# Altium schematic sheet [04].HMS.Output.SchDoc
size A4; SheetNumber: 5; SheetTotal: 7
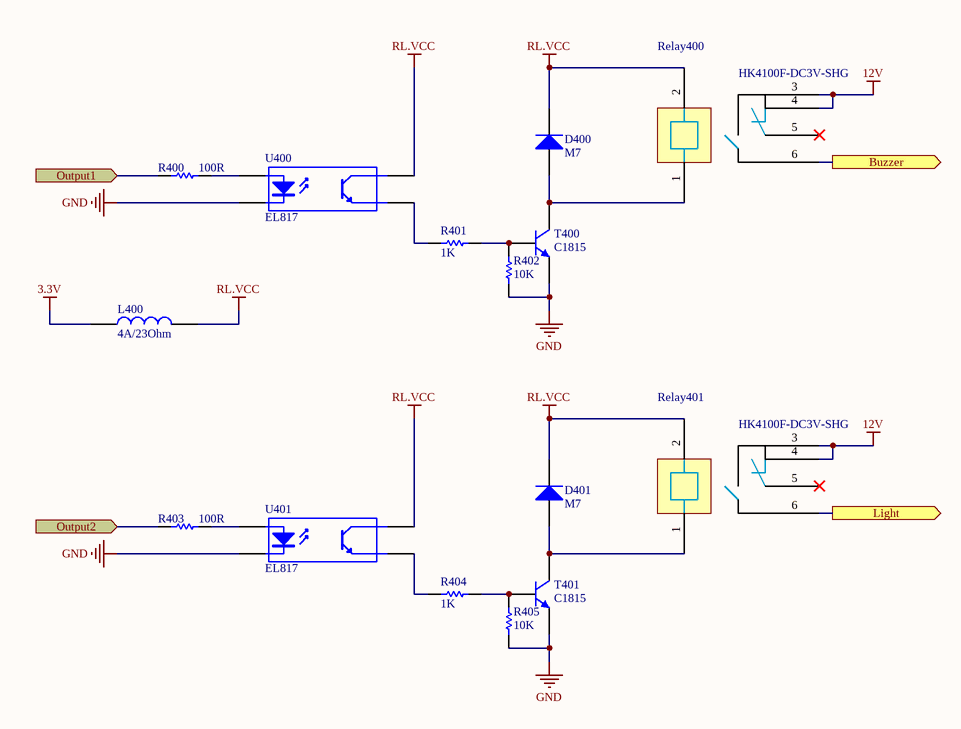
[diagram p0: [04].HMS.Output.SchDoc]

## Parts
D400  M7  [DO214AC_SMA_1808]
D401  M7  [DO214AC_SMA_1808]
L400  4A/23Ohm  [Inductor_0603]
R400  100R  [RES_0402(1005)]
R401  1K  [RES_0402(1005)]
R402  10K  [RES_0402(1005)]
R403  100R  [RES_0402(1005)]
R404  1K  [RES_0402(1005)]
R405  10K  [RES_0402(1005)]
Relay400  HK4100F-DC3V-SHG  [HK4001F]
Relay401  HK4100F-DC3V-SHG  [HK4001F]
T400  C1815  [SOT23-3]
T401  C1815  [SOT23-3]
U400  EL817  [Opto small]
U401  EL817  [Opto small]

## Ports
Buzzer (out), Light (out), Output1 (in), Output2 (in)

## Nets
3.3V: L400.1
12V: Relay400.3 Relay400.4 Relay401.3 Relay401.4
GND: R402.1 R405.1 T400.2(E) T401.2(E) U400.2 U401.2
RL.VCC: D400.2(K) D401.2(K) L400.2 Relay400.2 Relay401.2 U400.4 U401.4
Buzzer: Relay400.6 ; port Buzzer
Light: Relay401.6 ; port Light
Output1: R400.2 ; port Output1
Output2: R403.2 ; port Output2
NetD400_1: D400.1(A) Relay400.1 T400.3(C)
NetD401_1: D401.1(A) Relay401.1 T401.3(C)
NetR400_1: R400.1 U400.1
NetR401_1: R401.1 R402.2 T400.1(B)
NetR401_2: R401.2 U400.3
NetR403_1: R403.1 U401.1
NetR404_1: R404.1 R405.2 T401.1(B)
NetR404_2: R404.2 U401.3

Not connected (* = marked no-connect by the designer): Relay400 5*; Relay401 5*

## Library data of the parts
D400 D401 = Diode M7: Diode M7 - 1N4007; MPN: 1N4007 M7; Value: 1000V 1A; Published: 8-Jun-2000; LatestRevisionDate: 17-Jul-2002; LatestRevisionNote: Re-released for DXP Platform.; DatasheetDocument: 1997; PackageReference: DO-35; Publisher: Altium Limited; Code_JEDEC: DO-204-AH; ComponentLink1Description: Manufacturer Link; ComponentLink1URL: http://www.fairchildsemi.com/; ComponentLink2Description: Datasheet; ComponentLink2URL: http://www.fairchildsemi.com/ds/1N%2F1N4448.pdf; Category: Diode
L400 = FBMJ1608HM230NT: Inductor Ferrites 4A SMD 0603; MFR: Taiyo Yuden; MPN: FBMJ1608HM230NT; Category: Ferrite Beads and Chips; Value: 4A/23Ohm
R400 R403 = Res1: RES 100 OHM 1% 1/8W 0402; MPN: RC0402FR-7W100RL; MFR: YAGEO; Value: 300R; Published: 8-Jun-2000; LatestRevisionDate: 17-Jul-2002; LatestRevisionNote: Re-released for DXP Platform.; PackageReference: AXIAL-0.3; Publisher: Altium Limited; Category: Chip Resistor - Surface Mount
R401 R404 = Res1: RES 1K OHM 1% 1/8W 0402; MPN: RC0402FR-071KL; MFR: YAGEO; Published: 8-Jun-2000; LatestRevisionDate: 17-Jul-2002; LatestRevisionNote: Re-released for DXP Platform.; PackageReference: AXIAL-0.3; Publisher: Altium Limited; Value: 1K; Category: Chip Resistor - Surface Mount
R402 R405 = Res1: RES 10K OHM 5% 1/8W 0402; MPN: RC0402JR-0710KL; MFR: YAGEO; Published: 8-Jun-2000; LatestRevisionDate: 17-Jul-2002; LatestRevisionNote: Re-released for DXP Platform.; PackageReference: AXIAL-0.3; Publisher: Altium Limited; Value: 10K; Category: Chip Resistor - Surface Mount
Relay400 Relay401 = HK4100F: HK4100F-DC3V-SHG Relay 3V 3A 6 chân; MFR: OEM; Value: 3V3DC; MPN: HK4100F-DC3V-SHG; Category: Relay
T400 T401 = 2N3904: Trans C1815 NPN 0.15A/50V SMD SOT23; MPN: 2SC1815; MFR: LinhKienChatLuong; Value: 0.15A 60V SOT-23; Published: 8-Jun-2000; LatestRevisionDate: 15-Jan-2003; LatestRevisionNote: PCB Footprint 'BCY-W3/D4.7' replaced; DatasheetVersion: 1997; PackageVersion: Sep-1998; PackageReference: TO-92A; Publisher: Altium Limited; PackageDescription: TO, Flat Index; 3 In-Line, Axial Leads; Body Dia. 4.5mm; Leads 0.51 x 0.48 mm (max); ComponentLink1Description: Manufacturer Link; ComponentLink1URL: http://www.fairchildsemi.com/; ComponentLink2Description: Datasheet; ComponentLink2URL: http://www.fairchildsemi.com/ds/2N%2F2N3904.pdf; Category: Transistor NPN
U400 U401 = OPTOISO1: Optoisolator Transistor Output 3750Vrms 1 Channel 4-SOP; MFR: Vishay Semiconductor Opto Division; Value: 60V 50mA; Component Type: IC; MPN: EL817; Category: Optoisolators - Transistor, Photovoltaic Output